# Altium schematic sheet current_signal_adaptation.SchDoc
size A4; SheetNumber: 3; SheetTotal: 12
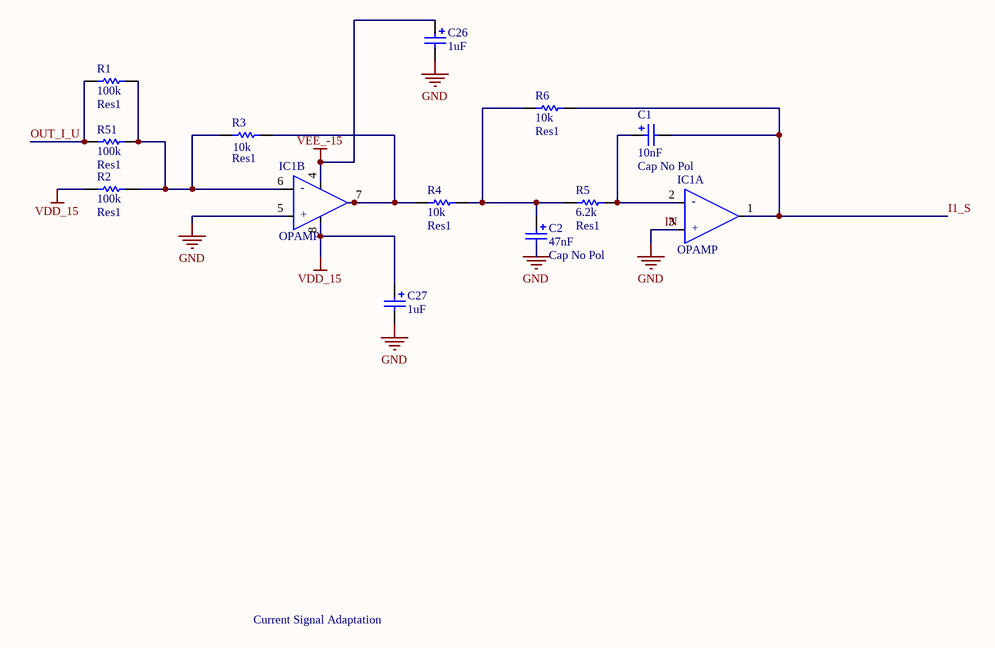
[diagram p0: current_signal_adaptation.SchDoc]

## Parts
C1  Cap No Pol  value 10nF  [RAD-0.1]
C2  Cap No Pol  value 47nF  [RAD-0.1]
C26  value 1uF  [RAD-0.1]  (hidden comment: Cap No Pol)
C27  value 1uF  [RAD-0.1]  (hidden comment: Cap No Pol)
IC1  OPAMP  [DIP-8]  (parts A,B of 2)
R1  Res1  value 100k  [AXIAL-0.4]
R2  Res1  value 100k  [AXIAL-0.4]
R3  Res1  value 10k  [AXIAL-0.4]
R4  Res1  value 10k  [AXIAL-0.4]
R5  Res1  value 6.2k  [AXIAL-0.4]
R6  Res1  value 10k  [AXIAL-0.4]
R51  Res1  value 100k  [AXIAL-0.4]

## Nets
IN: C2.2 C26.2 C27.2 IC1.3(IN_A_+) IC1.5(IN_B_+)  [also labelled GND]
VDD_15: C27.1 IC1.8(V+) R2.1
VEE_-15: C26.1 IC1.4(-V)
I1_S: C1.2 IC1.1(OUT_A) R6.2
OUT_I_U: R1.1 R51.1
NetC1_1: C1.1 IC1.2(IN_A_-) R5.2
NetC2_1: C2.1 R4.2 R5.1 R6.1
NetIC1_7: IC1.7(OUT_B) R3.2 R4.1
NetR1_2: R1.2 R2.2 R3.1 R51.2

Not connected (* = marked no-connect by the designer): IC1 6(IN_B_-)

## Notes on the sheet
- Current Signal Adaptation
- (in symbol ADTL082, part A) -; +
- (in symbol ADTL082, part B) -; +

## Library data of the parts
C1 C2 C26 C27 = Cap No Pol: Polarized Capacitor (Radial); Published: 8-Jun-2000; LatestRevisionDate: 17-Jul-2002; LatestRevisionNote: Re-released for DXP Platform.; PackageReference: RB7.6-15; Publisher: Altium Limited; PackageDescription: Polarized Capacitor (Radial); 2 Leads
IC1 = ADTL082
R1-R6 R51 = Res1: Resistor; Published: 8-Jun-2000; LatestRevisionDate: 17-Jul-2002; LatestRevisionNote: Re-released for DXP Platform.; PackageReference: AXIAL-0.3; Publisher: Altium Limited; PackageDescription: Axial Device, Thru-Hole; 2 Leads; 0.3 in Pin Spacing